# Altium project 171-5783_Redux.PrjPcb
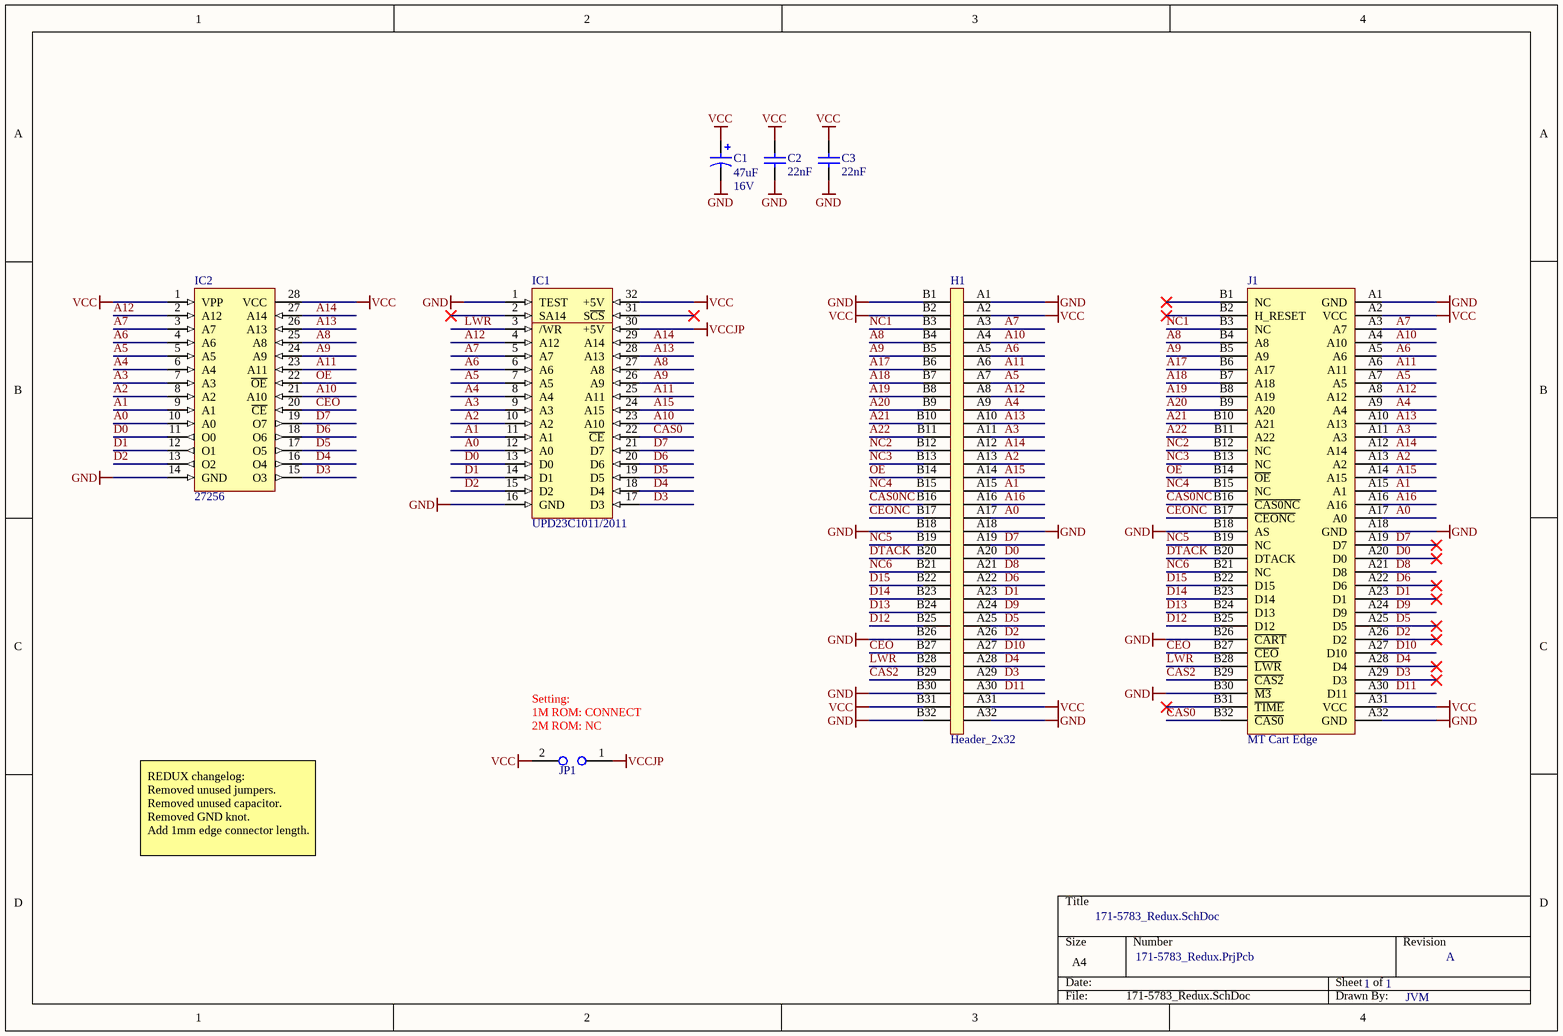
[diagram p0: 171-5783_Redux.SchDoc]
1 sheet, 8 parts. Net scope: global (net labels, ports and power ports of the same name join across sheets).
Board file: 171-5783_Redux.PcbDoc

## Sheet 171-5783_Redux.SchDoc
size A4; SheetNumber: 1; SheetTotal: 1

### Parts
C1  value 47uF  Voltage: 16V  [CapPol Mirror]  (hidden comment: Cap2.54P5.0D)
C2  value 22nF  [CapCer]  (hidden comment: CapCer)
C3  value 22nF  [CapCer]  (hidden comment: CapCer)
H1  Header_2x32  [Header_2x32]  (no BOM)
IC1  UPD23C1011/2011  [UPD23C1011/2011]
IC2  27256  [27256]
J1  MT Cart Edge  [MT_Cart_Edge]  (no BOM)
JP1  SolderBridge  [SOLDER_BRIDGE]  (value not drawn)  (no BOM)

### Nets
GND: C1.2 C2.1 C3.1 H1.A1 H1.A18 H1.A32 H1.B1 H1.B18 H1.B26 H1.B30 H1.B32 IC1.1(TEST) IC1.16(GND) IC2.14(GND) J1.A1(GND) J1.A18(GND) J1.A32(GND) J1.B18(AS) J1.B26(~{CART}) J1.B30(~{M3})
VCC: C1.1 C2.2 C3.2 H1.A2 H1.A31 H1.B2 H1.B31 IC1.32(+5V) IC2.1(VPP) IC2.28(VCC) J1.A2(VCC) J1.A31(VCC) JP1.2
VCCJP: IC1.30(+5V) JP1.1
A0: H1.A17 IC1.12(A0) IC2.10(A0) J1.A17(A0)
A1: H1.A15 IC1.11(A1) IC2.9(A1) J1.A15(A1)
A2: H1.A13 IC1.10(A2) IC2.8(A2) J1.A13(A2)
A3: H1.A11 IC1.9(A3) IC2.7(A3) J1.A11(A3)
A4: H1.A9 IC1.8(A4) IC2.6(A4) J1.A9(A4)
A5: H1.A7 IC1.7(A5) IC2.5(A5) J1.A7(A5)
A6: H1.A5 IC1.6(A6) IC2.4(A6) J1.A5(A6)
A7: H1.A3 IC1.5(A7) IC2.3(A7) J1.A3(A7)
A8: H1.B4 IC1.27(A8) IC2.25(A8) J1.B4(A8)
A9: H1.B5 IC1.26(A9) IC2.24(A9) J1.B5(A9)
A10: H1.A4 IC1.23(A10) IC2.21(A10) J1.A4(A10)
A11: H1.A6 IC1.25(A11) IC2.23(A11) J1.A6(A11)
A12: H1.A8 IC1.4(A12) IC2.2(A12) J1.A8(A12)
A13: H1.A10 IC1.28(A13) IC2.26(A13) J1.A10(A13)
A14: H1.A12 IC1.29(A14) IC2.27(A14) J1.A12(A14)
A15: H1.A14 IC1.24(A15) J1.A14(A15)
A16: H1.A16 J1.A16
A17: H1.B6 J1.B6(A17)
A18: H1.B7 J1.B7(A18)
A19: H1.B8 J1.B8(A19)
A20: H1.B9 J1.B9(A20)
A21: H1.B10 J1.B10(A21)
A22: H1.B11 J1.B11(A22)
CAS0: IC1.22(~{CE}) J1.B32(~{CAS0})
CAS0NC: H1.B16 J1.B16(~{CAS0NC})
CAS2: H1.B29 J1.B29(~{CAS2})
CEO: H1.B27 IC2.20(~{CE}) J1.B27(~{CEO})
CEONC: H1.B17 J1.B17(~{CEONC})
D0: H1.A20 IC1.13(D0) IC2.11(O0) J1.A20(D0)
D1: H1.A23 IC1.14(D1) IC2.12(O1) J1.A23(D1)
D2: H1.A26 IC1.15(D2) IC2.13(O2) J1.A26(D2)
D3: H1.A29 IC1.17(D3) IC2.15(O3) J1.A29(D3)
D4: H1.A28 IC1.18(D4) IC2.16(O4) J1.A28(D4)
D5: H1.A25 IC1.19(D5) IC2.17(O5) J1.A25(D5)
D6: H1.A22 IC1.20(D6) IC2.18(O6) J1.A22(D6)
D7: H1.A19 IC1.21(D7) IC2.19(O7) J1.A19(D7)
D8: H1.A21 J1.A21(D8)
D9: H1.A24 J1.A24(D9)
D10: H1.A27 J1.A27(D10)
D11: H1.A30 J1.A30(D11)
D12: H1.B25 J1.B25(D12)
D13: H1.B24 J1.B24(D13)
D14: H1.B23 J1.B23(D14)
D15: H1.B22 J1.B22(D15)
DTACK: H1.B20 J1.B20(DTACK)
LWR: H1.B28 IC1.3(/WR) J1.B28(~{LWR})
NC1: H1.B3 J1.B3(NC)
NC2: H1.B12 J1.B12(NC)
NC3: H1.B13 J1.B13(NC)
NC4: H1.B15 J1.B15(NC)
NC5: H1.B19 J1.B19(NC)
NC6: H1.B21 J1.B21(NC)
OE: H1.B14 IC2.22(~{OE}) J1.B14(~{OE})

Not connected (* = marked no-connect by the designer): IC1 2(SA14)* 31(S~{CS})*; J1 B1(NC)* B2(H_RESET)* B31(~{TIME})*

### Notes on the sheet
- (near JP1) 1M ROM: CONNECT
- Setting:
- (near JP1) 2M ROM: NC
- REDUX changelog:
  Removed unused jumpers.
  Removed unused capacitor.
  Removed GND knot.
  Add 1mm edge connector length.
- A
- JVM

### Library data of the parts
C1 = Cap2.54P5.0D_mirror: Polarized Capacitor, 2.54mm Pitch, 5mm Width, mirrored
C2 C3 = CapCer: Capacitor (THT), Ceramic, 5.08mm Pitch
IC1 = UPD23C1011/2011: SMS Mapper Mask Rom, Dual footprint
IC2 = 27256: 256K EPROM
J1 = MT_CART_EDGE_CON
JP1 = SolderBridge: Solder Bridge